# EAGLE design Untitled (EAGLE 7.5.0)
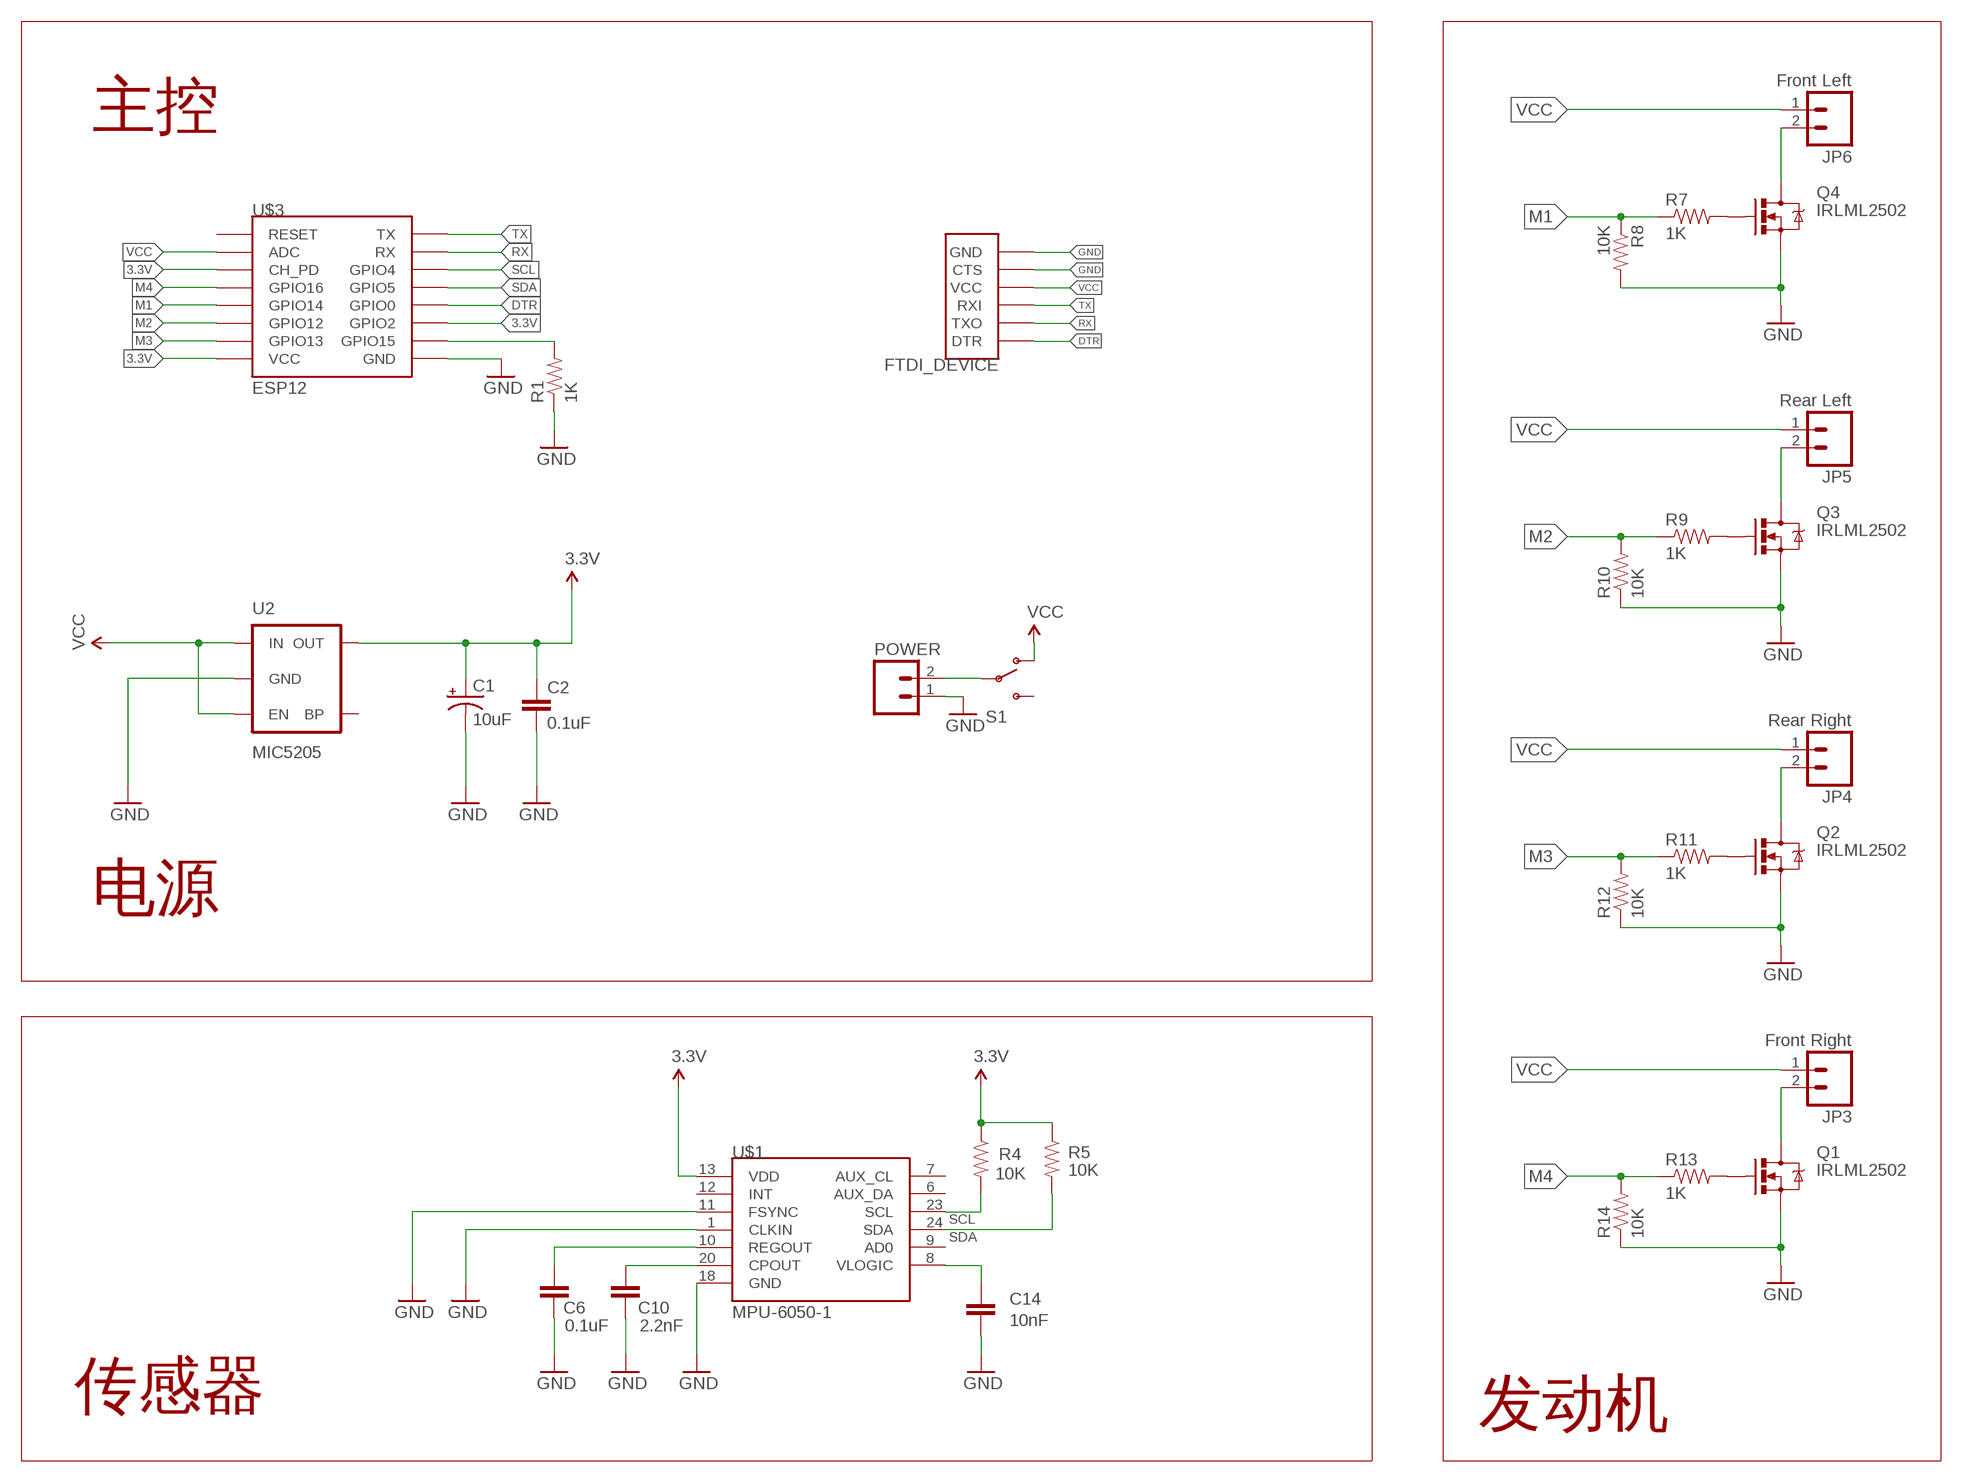
[diagram p0: schematic, sheet 1]

## Parts
C1  10uF  CAP_POL1206  [EIA3216]
C2  0.1uF  CAP0402-CAP  [0402-CAP]
C6  0.1uF  CAP0402-CAP  [0402-CAP]
C10  2.2nF  CAP0402-CAP  [0402-CAP]
C14  10nF  CAP0402-CAP  [0402-CAP]
FTDI  FTDI_DEVICE  [FTDI_DEVICE_SIDE]
JP3  Front Right  M02PTH3  [1X02_LONGPADS]
JP4  Rear Right  M02PTH3  [1X02_LONGPADS]
JP5  Rear Left  M02PTH3  [1X02_LONGPADS]
JP6  Front Left  M02PTH3  [1X02_LONGPADS]
POWER  M02PTH  [1X02]
Q1  IRLML2502  MOSFET-NCHANNELBSS138  [SOT23]
Q2  IRLML2502  MOSFET-NCHANNELBSS138  [SOT23]
Q3  IRLML2502  MOSFET-NCHANNELBSS138  [SOT23]
Q4  IRLML2502  MOSFET-NCHANNELBSS138  [SOT23]
R1  1K  RESISTOR0402-RES  [0402-RES]
R4  10K  RESISTOR0402-RES  [0402-RES]
R5  10K  RESISTOR0402-RES  [0402-RES]
R7  1K  RESISTOR0402-RES  [0402-RES]
R8  10K  RESISTOR0402-RES  [0402-RES]
R9  1K  RESISTOR0402-RES  [0402-RES]
R10  10K  RESISTOR0402-RES  [0402-RES]
R11  1K  RESISTOR0402-RES  [0402-RES]
R12  10K  RESISTOR0402-RES  [0402-RES]
R13  1K  RESISTOR0402-RES  [0402-RES]
R14  10K  RESISTOR0402-RES  [0402-RES]
S1  SWITCH-SPDTSMD2  [SWITCH-SPDT-SMD]
U2  MIC5205  MIC52055V  [SOT23-5]
U$1  MPU-6050-1  [QFN-24-4MM2]
U$3  ESP12  [ESP12]

## Nets
3.3V: C1.A(+) C2.1 R4.1 R5.1 U2.5(OUT) U$1.13(VDD) U$3.CH_PD U$3.GPIO2 U$3.VCC
DTR: FTDI.P$1(DTR) U$3.GPIO0
GND: C1.C(-) C2.2 C6.1 C10.1 C14.1 FTDI.P$5(CTS) FTDI.P$6(GND) POWER.1 Q1.2(S) Q2.2(S) Q3.2(S) Q4.2(S) R1.1 R8.2 R10.1 R12.1 R14.1 U2.2(GND) U$1.1(CLKIN) U$1.11(FSYNC) U$1.18(GND) U$3.GND
M1: R7.1 R8.1 U$3.GPIO14
M2: R9.1 R10.2 U$3.GPIO12
M3: R11.1 R12.2 U$3.GPIO13
M4: R13.1 R14.2 U$3.GPIO16
N$3: JP3.2 Q1.3(D)
N$5: C14.2 U$1.8(VLOGIC)
N$6: POWER.2 S1.2(P)
N$8: JP4.2 Q2.3(D)
N$12: JP5.2 Q3.3(D)
N$14: JP6.2 Q4.3(D)
N$20: R1.2 U$3.GPIO15
N$29: C6.2 U$1.10(REGOUT)
N$32: C10.2 U$1.20(CPOUT)
N$38: Q4.1(G) R7.2
N$39: Q3.1(G) R9.2
N$40: Q2.1(G) R11.2
N$41: Q1.1(G) R13.2
RX: FTDI.P$2(TXO) U$3.RX
SCL: R4.2 U$1.23(SCL) U$3.GPIO4
SDA: R5.2 U$1.24(SDA) U$3.GPIO5
TX: FTDI.P$3(RXI) U$3.TX
VCC: FTDI.P$4(VCC) JP3.1 JP4.1 JP5.1 JP6.1 S1.1(O) U2.1(IN) U2.3(EN) U$3.ADC
Unconnected: S1.3(S) U2.4(BP) U$1.6(AUX_DA) U$1.7(AUX_CL) U$1.9(AD0) U$1.12(INT) U$3.RESET

## Notes on the sheet
- 主控
- 电源
- 传感器 | 发动机

## Library data of the parts
C1 = SparkFun-Capacitors:CAP_POL: Capacitor Polarized These are standard SMD and PTH capacitors. Normally 10uF, 47uF, and 100uF in electrolytic and tantalum varieties. Always verify the external diameter of the through hole cap, it varies with capacity, voltage, and manufacturer. The EIA devices should be standard.
C2 C6 C10 C14 = SparkFun-Capacitors:CAP: Capacitor Standard 0603 ceramic capacitor, and 0.1" leaded capacitor.
FTDI = SparkFun-Connectors:FTDI_DEVICE: Connector which mates to FTDI basic or FTDI cable.
JP3-JP6 POWER = SparkFun-Connectors:M02: Standard 2-pin 0.1" header. Use with - straight break away headers ( PRT-00116) - right angle break away headers (PRT-00553) - swiss pins (PRT-00743) - machine pins (PRT-00117) - female headers (PRT-00115) Molex polarized connector foot print use with: PRT-08233 with associated crimp pins and housings. 2.54_SCREWTERM for use with PRT-10571. 3.5mm Screw Terminal footprints for PRT-08084 5mm Screw Terminal footprints for use with PRT-08433
Q1-Q4 = SparkFun-DiscreteSemi:MOSFET-NCHANNEL: Common NMOSFET Parts MFG P/N Store ID Prod ID FDD8780 TRANS-09984 SI7820DN TRANS-11055 FDS6630A IC-08089 2N7002PW TRANS-11151 FQP30N06L COM-10213 TRANS-10060 BSS123LT1G TRANS-08345 BSS138 TRANS-00830 BS170 2N7000; PROD_ID: TRANS-00830
R1 R4 R5 R7-R14 = SparkFun-Passives:RESISTOR: Resistor Basic schematic elements and footprints for 0603, 1206, and PTH resistors.
S1 = SparkFun-Electromechanical:SWITCH-SPDT: SPDT Switch Simple slide switch, Spark Fun Electronics SKU : COM-00102 DPDT SMT slide switch, AYZ0202, SWCH-08179
U2 = SparkFun-PowerIC:MIC5205: MIC5205 150mA vreg 3.3V - VREG-00822 5V - VREG-00823; PROD_ID: VREG-00823
U$1 = Testing:MPU-6050
U$3 = esp8266modules:ESP12: ESP8266 Wifi module 12

## Board
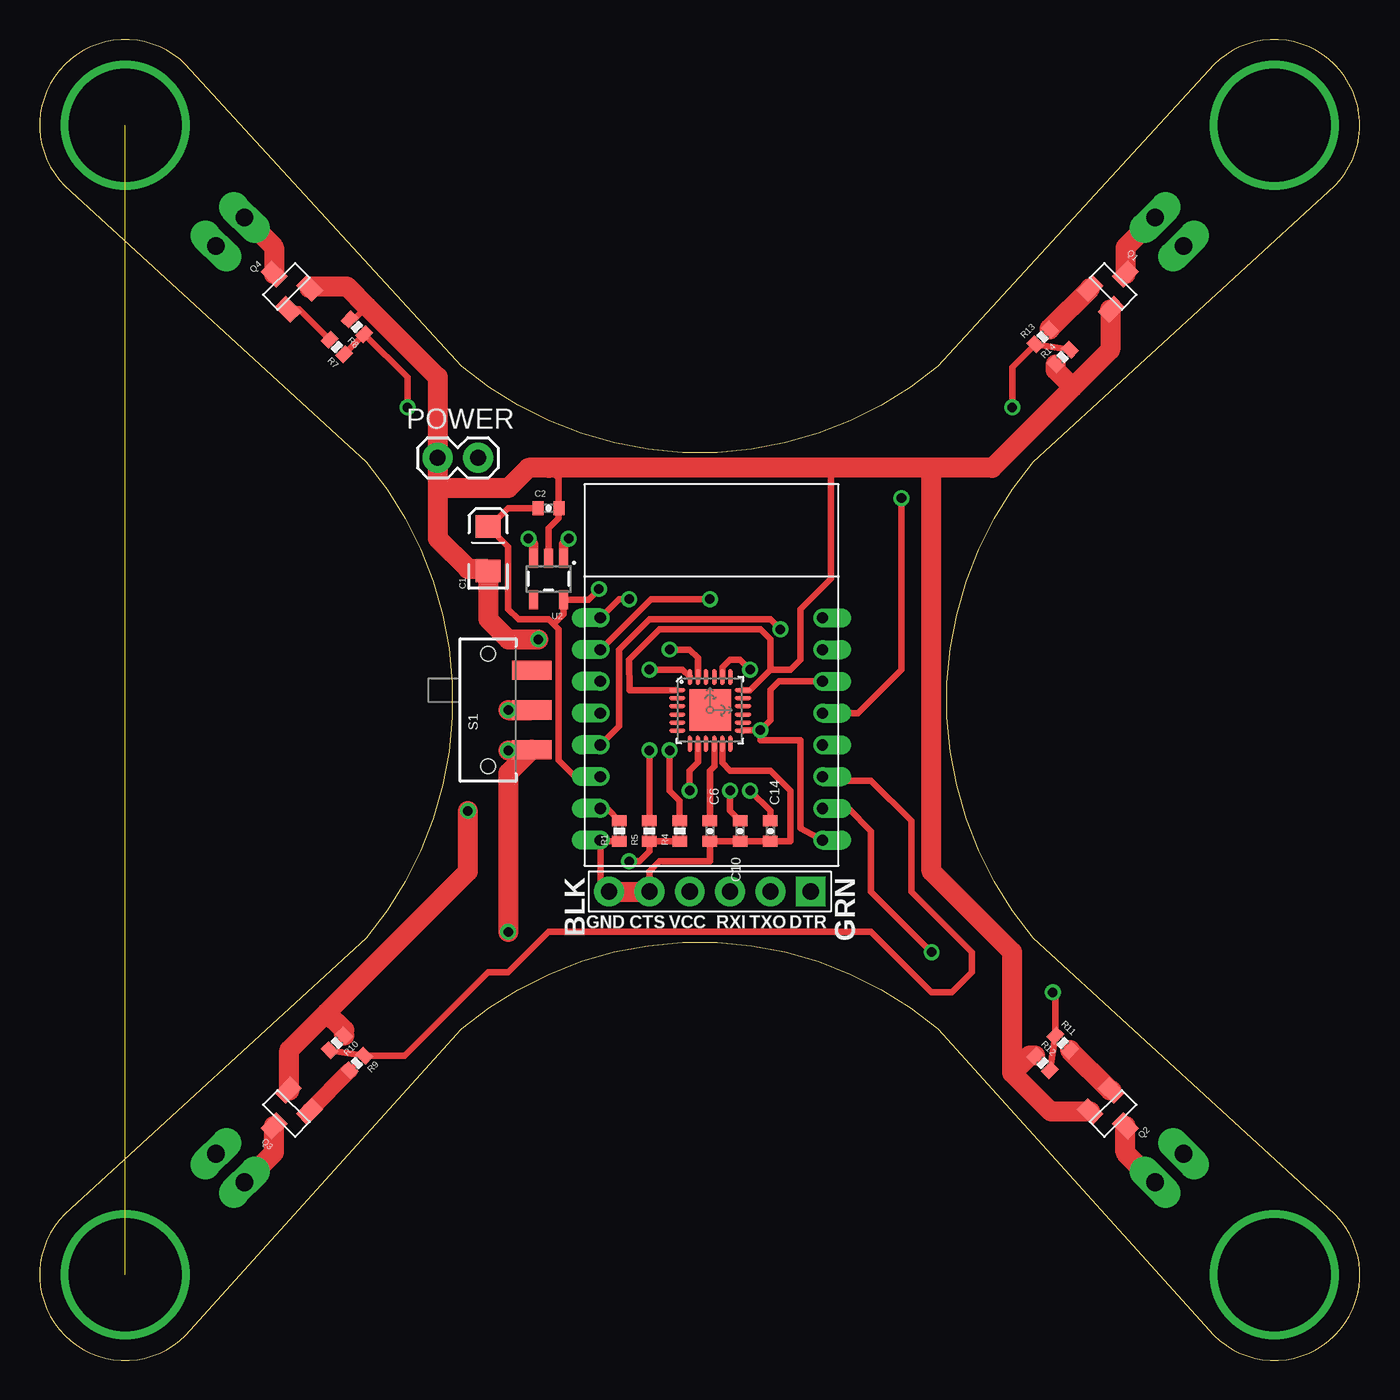
[diagram p1: board, top side]
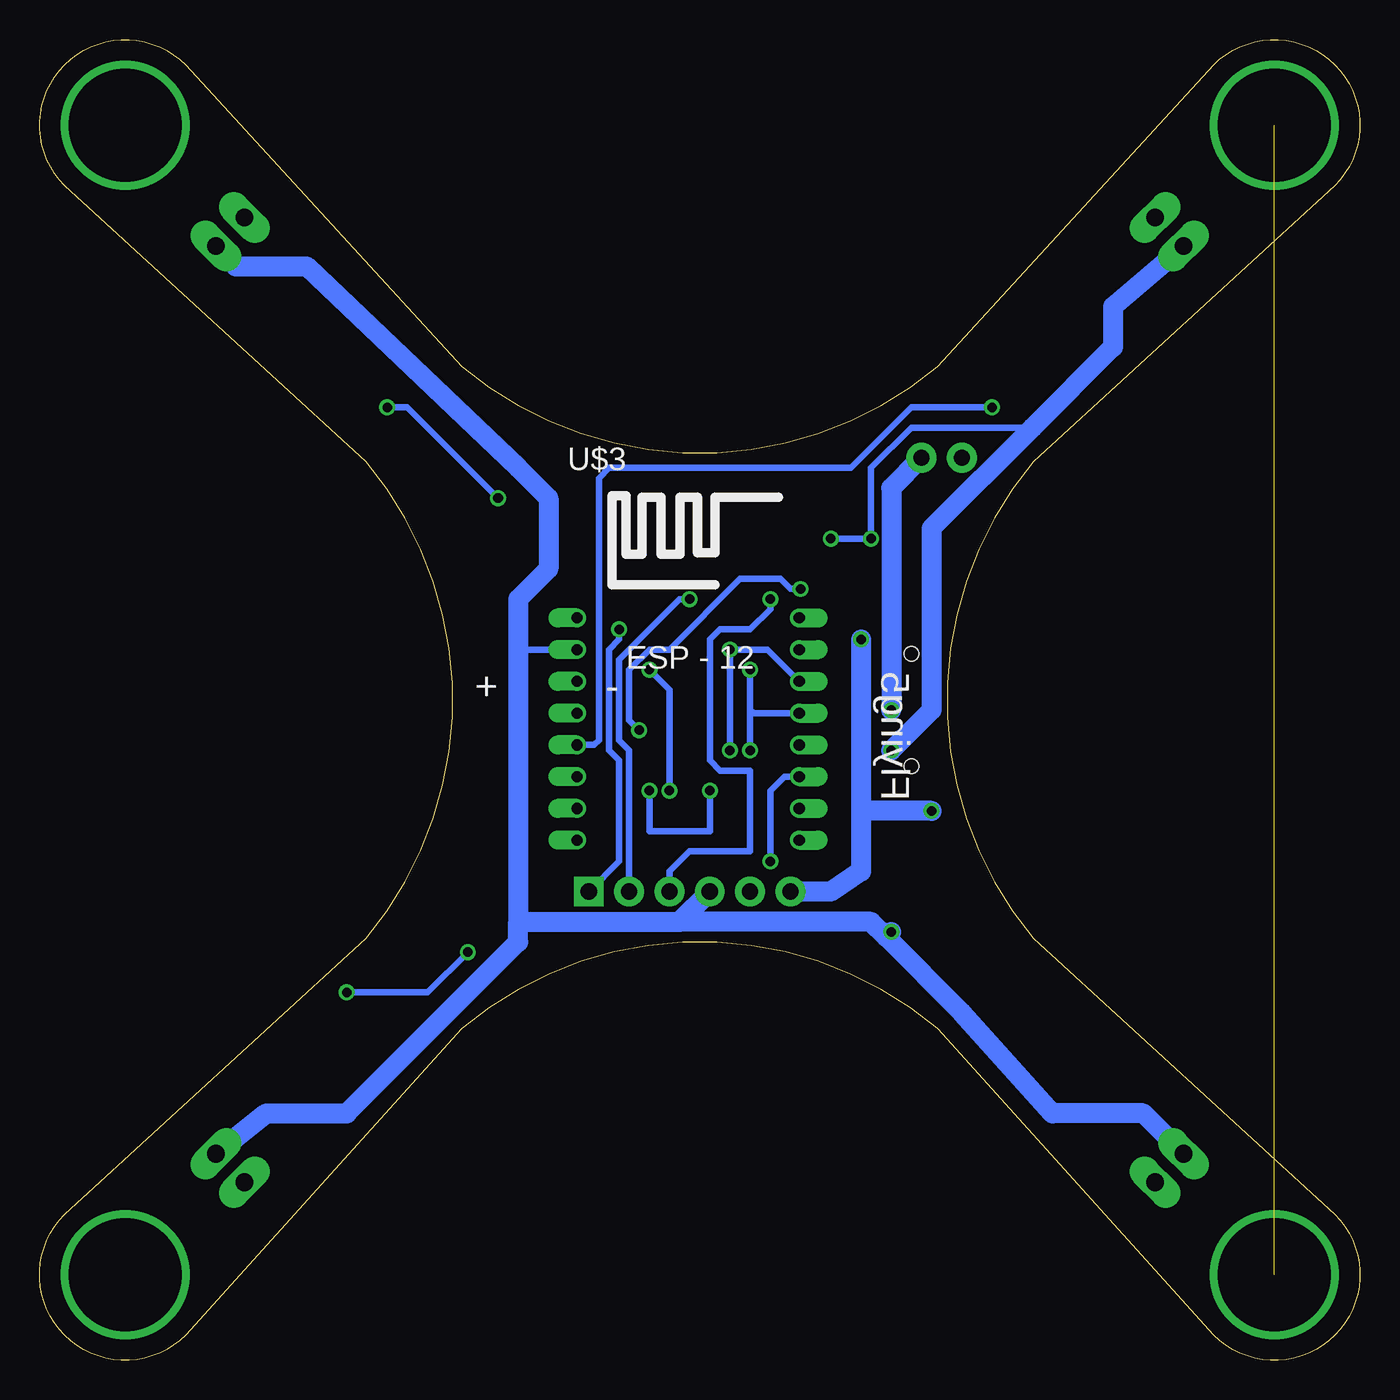
[diagram p2: board, bottom side, seen from below]

Size 83.15 x 83.15 mm. Coordinates in mm from the lower left corner, seen from the top.
Outline: 1.57,1.57 arc90 9.19,1.57 26.57,20.88 arc-80 56.57,20.88 73.96,1.57 arc90 81.57,1.57 arc90 81.58,9.19 62.59,26.57 arc-80 62.59,56.57 81.57,73.95 arc90 81.57,81.57 arc90 73.96,81.58 56.57,62.59 arc-80 26.57,62.59 9.2,81.57 arc90 1.57,81.57 arc90 1.57,73.96 20.56,56.57 arc-80 20.56,26.57 1.57,9.19 arc90 1.57,1.57
Copper layers (1*16): Top 0.035mm / dielectric 1.5mm / Bottom 0.035mm
Design rules "default": minimum track width 10mil, minimum drill 24mil, track to track 8mil, track to pad 8mil, pad to pad 8mil, via to via 8mil, smd to smd 8mil, copper to edge 40mil, drill to drill 8mil, minimum pad ring 10mil, minimum via ring 8mil, stop-mask expansion 4mil, vias tented up to drill 0mil, thermal gap 10mil

### Footprints (pad centres in the part's own frame; a part is rotated, then mirrored left to right if it is on the bottom)
EIA3216 = smd 1.4 x 1.6: A 1.4,0; C -1.4,0
0402-CAP = smd 0.7 x 0.9: 1 -0.65,0; 2 0.65,0
FTDI_DEVICE_SIDE = drill 1.016 pad 1.88 square: P$1 -6.35,0 | drill 1.016 pad 1.88: P$2 -3.81,0; P$3 -1.27,0; P$4 1.27,0; P$5 3.81,0; P$6 6.35,0
1X02_LONGPADS = drill 1.118 pad 1.88 long: 1 0,0; 2 2.54,0
1X02 = drill 1.016 pad 1.88: 1 0,0; 2 2.54,0
SOT23 = smd 1 x 1.4: 1 -0.95,-1.1; 2 0.95,-1.1; 3 0,1.1
0402-RES = smd 0.7 x 0.9: 1 -0.65,0; 2 0.65,0
SWITCH-SPDT-SMD = smd 1.2 x 2.5: 1 -2.5,-2.75; 2 0,-2.75; 3 2.5,-2.75 | hole 0.9: -3.55,0; 3.55,0
SOT23-5 = smd 0.55 x 1.2: 1 -0.95,-1.3; 2 0,-1.3; 3 0.95,-1.3; 4 0.95,1.3; 5 -0.95,1.3
QFN-24-4MM2 = smd 1.016 x 0.254: 1 -2.066,1.257; 2 -2.066,0.75; 3 -2.066,0.247; 4 -2.066,-0.287; 5 -2.066,-0.792; 6 -2.066,-1.297; 13 2.086,-1.297; 14 2.086,-0.792; 15 2.086,-0.287; 16 2.086,0.247; 17 2.086,0.75; 18 2.086,1.257 | smd 0.254 x 1.016: 7 -1.267,-2.122; 8 -0.762,-2.122; 9 -0.258,-2.122; 10 0.278,-2.122; 11 0.78,-2.122; 12 1.287,-2.122; 19 1.287,2.082; 20 0.78,2.082; 21 0.278,2.082; 22 -0.258,2.082; 23 -0.762,2.082; 24 -1.267,2.082 | smd 2.616 x 2.616: P$1 0.02,-0.01
ESP12 = drill 0.7 offset: ADC -7.1,3.8; CH_PD -7.1,1.8; GND 6.9,-8.2; GPIO0 6.9,-2.2; GPIO2 6.9,-4.2; GPIO4 6.9,1.8; GPIO5 6.9,-0.2; GPIO12 -7.1,-4.2; GPIO13 -7.1,-6.2; GPIO14 -7.1,-2.2; GPIO15 6.9,-6.2; GPIO16 -7.1,-0.2; RESET -7.1,5.8; RX 6.9,3.8; TX 6.9,5.8; VCC -7.1,-8.2

### Placement (x,y rotation side)
C1  28.24,51.1 90 top
C2  32.05,53.64 0 top
C6  42.21,33.32 90 top
C10  44.12,33.32 90 top
C14  46.02,33.32 90 top
FTDI  42.21,29.51 180 top
JP3  72.06,70.15 135 top
JP4  72.06,13 225 top
JP5  11.1,13 315 top
JP6  11.1,70.15 45 top
POWER  25.07,56.82 0 top
Q1  67.61,67.61 315 top
Q2  67.61,15.54 225 top
Q3  15.54,15.54 135 top
Q4  15.54,67.61 45 top
R1  36.5,33.32 90 top
R4  40.31,33.32 90 top
R5  38.4,33.32 90 top
R7  18.72,63.8 135 top
R8  19.99,65.07 135 top
R9  19.99,18.72 225 top
R10  18.72,19.99 225 top
R11  64.44,19.99 315 top
R12  63.17,18.72 315 top
R13  63.17,64.44 45 top
R14  64.44,63.17 45 top
S1  28.24,40.94 90 top
U2  32.05,49.2 180 top
U$1  42.21,40.94 0 top
U$3  42.21,40.94 0 bottom

### Tracks (layer width: path | path; a pad name or v marks a point on that pad's centre or on a via)
3.3V  (via drill 0.6)
  Top 0.406: C2.1 29.51,53.64 28.37,52.5 C1.A 29.51,51.23 29.51,47.29 30.15,46.66 32.05,46.66 32.37,46.34 | U$3.GPIO2 33.71,36.74 32.69,37.77 32.69,46.02 32.37,46.34 | 32.37,46.34 33,46.97 U2.5 34.56,47.9 v35.23,48.56 | R4.1 R5.1 38.4,32.05 37.77,31.42 v37.13,31.42 | U$1.13 44.33,39.67 v45.39,39.67 | U$3.CH_PD 46.55,42.74 46.02,42.21 46.02,40.31 v45.39,39.67 | v45.39,39.67 45.39,39.04 47.93,39.04 47.93,33.49 U$3.VCC
  Bottom 0.406: U$3.GPIO2 36.25,36.74 37.13,35.86 v37.13,31.42 | v45.39,39.67 46.02,40.31 46.02,43.48 44.75,44.75 43.48,44.75 39.04,49.2 36.5,49.2 35.86,48.56 v35.23,48.56
DTR  (via drill 0.6)
  Top 0.406: U$3.GPIO0 36.5,39.93 36.5,44.75 38.4,46.66 46.02,46.66 v46.66,46.02
  Bottom 0.406: v46.66,46.02 46.66,45.39 47.29,44.75 47.29,38.4 46.66,37.77 46.66,31.42 FTDI.P$1
GND  (via drill 0.6)
  Top 0.406: FTDI.P$6 35.31,30.06 U$3.GND 35.38,32.67 R1.1 | C6.1 42.85,32.69 | C6.1 42.21,31.42 39.04,31.42 38.4,30.78 FTDI.P$5 | R8.2 19.81,65.53 20.62,66.34 | Q1.2 67.43,66.16 | 32.7,56.17 32.69,56.18 | U$1.1 37.15,42.2 37.13,44.12 39.04,46.02 45.39,46.02 46.02,45.39 46.02,43.48 | 46.02,43.48 47.29,43.48 47.93,44.12 47.93,47.29 49.83,49.2 49.83,56.18 | U$1.18 44.74,42.2 46.02,43.48 | U2.2 32.05,52.37 32.69,53.01 32.69,53.63 | 32.69,53.63 32.69,55.55 32.05,56.18 | 32.69,53.63 C2.2 | U$1.11 42.99,37.62 43.48,37.13 46.02,37.13 47.29,35.86 47.29,32.69 46.67,32.69 C14.1 C10.1 C6.1
  Top 1.016: Q3.2 15.72,16.99
  Top 1.27: Q4.2 17.1,67.61 19.35,67.61 20.62,66.34 25.07,61.9 POWER.1 25.07,54.91 | 25.07,54.91 25.07,51.74 26.97,49.83 28.11,49.83 C1.C 28.24,46.66 29.51,45.39 v31.42,45.39 | FTDI.P$6 FTDI.P$5 | 15.72,16.99 15.72,19.53 18.08,21.89 | R10.1 19.18,20.8 18.08,21.89 | Q2.2 63.7,15.65 61.26,18.08 | R12.1 62.36,19.18 61.26,18.08 | 67.43,66.16 67.43,63.62 65.07,61.26 | 65.07,61.26 59.99,56.18 56.18,56.18 | 56.18,56.18 49.83,56.18 32.69,56.18 32.05,56.18 30.78,56.18 29.51,54.91 25.07,54.91 | R14.1 63.98,62.36 65.07,61.26 | 18.08,21.89 26.97,30.78 v26.97,34.59 | 61.26,18.08 61.26,25.7 56.18,30.78 56.18,56.18
  Bottom 1.27: v31.42,45.39 31.42,34.59 | 31.42,34.59 31.42,30.78 33.32,29.51 FTDI.P$6 | v26.97,34.59 31.42,34.59
M1  (via drill 0.6)
  Top 0.406: R7.1 R8.1 23.16,61.9 v23.16,59.99
  Bottom 0.406: v23.16,59.99 28.24,59.99 32.05,56.18 47.29,56.18 47.93,55.55 47.93,39.04 48.22,38.74 U$3.GPIO14
M2
  Top 0.406: U$3.GPIO12 49.56,36.5 52.37,36.5 54.91,33.96 54.91,29.51 58.72,25.7 58.72,24.43 57.45,23.16 56.18,23.16 52.37,26.97 32.05,26.97 29.51,24.43 28.24,24.43 22.99,19.18 R9.1 R10.2
M3  (via drill 0.6)
  Top 0.406: U$3.GPIO13 50.95,34.74 52.37,33.32 52.37,29.51 v56.18,25.7 | v63.8,23.16 63.98,22.99 R11.1 R12.2
  Bottom 0.406: v56.18,25.7 58.72,23.16 v63.8,23.16
M4  (via drill 0.6)
  Top 0.406: R14.2 R13.1 61.26,62.53 v61.26,59.99 | U$3.GPIO16 51.54,40.74 54.28,43.48 v54.28,54.28
  Bottom 0.406: v54.28,54.28 59.99,59.99 v61.26,59.99
N$1  (via drill 7.11)  (1 unrouted)
  other vias: 5.38,77.77 5.38,5.38
N$2  (via drill 7.11)
  other vias: 77.77,77.77
N$3
  Top 1.27: JP3.2 68.39,70.08 Q1.3
N$4  (via drill 7.11)
  other vias: 77.77,5.38
N$5  (via drill 0.6)
  Top 0.406: U$1.8 41.45,37.64 40.94,37.13 v40.94,35.86 | v44.75,35.86 46.02,34.59 C14.2
  Bottom 0.406: v40.94,35.86 40.94,33.32 44.75,33.32 v44.75,35.86
N$6  (via drill 0.6)
  Top 1.27: v29.51,40.94 S1.2
  Bottom 1.27: POWER.2 29.51,54.91 v29.51,40.94
N$8
  Top 1.27: JP4.2 68.39,13.08 Q2.3
N$12
  Top 1.27: JP5.2 14.76,13.08 Q3.3
N$14
  Top 1.27: JP6.2 14.76,70.08 Q4.3
N$20
  Top 0.406: U$3.GPIO15 35.73,34.74 R1.2
N$29
  Top 0.406: U$1.10 42.49,37.41 42.21,37.13 C6.2
N$32  (via drill 0.6)
  Top 0.406: U$1.20 42.99,43.63 43.48,44.12 44.12,44.12 v44.75,43.48 | C10.2 44.1,33.97 43.48,34.59 v43.48,35.86
  Bottom 0.406: v44.75,43.48 43.48,42.21 v43.48,35.86
N$38
  Top 0.406: Q4.1 16.36,66.16 R7.2
N$39
  Top 1.016: Q3.1 16.99,15.72 R9.2
N$40
  Top 1.27: Q2.1 67.43,16.99 R11.2
N$41
  Top 1.27: Q1.1 63.63,64.97 R13.2
RX  (via drill 0.6)
  Top 0.406: v42.21,47.93 38.5,47.93 U$3.RX
  Bottom 0.406: FTDI.P$2 46.02,38.4 46.66,39.04 46.66,44.12 42.85,47.93 v42.21,47.93
SCL  (via drill 0.6)
  Top 0.406: R4.2 40.31,35.23 39.67,35.86 v39.67,38.4 | U$1.23 41.45,44.24 40.94,44.75 v39.67,44.75
  Bottom 0.406: U$3.GPIO4 37.32,44.75 v39.67,44.75 v39.67,38.4
SDA  (via drill 0.6)
  Top 0.406: U$1.24 40.49,43.48 v38.4,43.48 | R5.2 v38.4,38.4
  Bottom 0.406: v38.4,38.4 38.4,40.94 | 38.4,40.94 v38.4,43.48 | U$3.GPIO5 38.2,40.74 38.4,40.94
TX  (via drill 0.6)
  Top 0.406: U$3.TX 36.5,47.93 v37.13,47.93
  Bottom 0.406: v37.13,47.93 37.13,47.29 38.4,46.02 40.31,46.02 40.94,45.39 40.94,37.77 40.31,37.13 38.4,37.13 38.4,32.05 42.21,32.05 43.48,30.78 FTDI.P$3
VCC  (via drill 0.6)
  Top 0.61: U2.1 33,51.42 v33.32,51.74 | U2.3 31.1,51.42 v30.78,51.74
  Top 1.27: v29.51,26.97 29.51,36.96 S1.1 30.95,38.4 v29.51,38.4
  Bottom 0.406: U$3.ADC 53.01,44.75 | v33.32,51.74 v30.78,51.74 30.78,56.18 28.24,58.72 20.62,58.72
  Bottom 1.27: JP6.1 15.54,66.34 15.54,63.8 20.62,58.72 26.97,52.37 26.97,40.94 v29.51,38.4 | JP3.1 70.79,68.88 66.34,68.88 53.01,56.18 51.1,54.28 51.1,49.83 53.01,47.93 53.01,44.75 53.01,27.61 | 53.01,27.61 42.85,27.61 | 42.85,27.61 FTDI.P$4 | JP4.1 68.88,15.54 63.8,15.54 53.01,26.34 53.01,27.61 | JP5.1 13.64,15.54 19.35,15.54 25.07,21.89 29.83,26.65 | 29.83,26.65 30.78,27.61 42.85,27.61 | v29.51,26.97 29.83,26.65

### Text on the board
bNames: - | + | Flying5